# Altium schematic sheet CC2530传感器功能底板.SchDoc
size A3
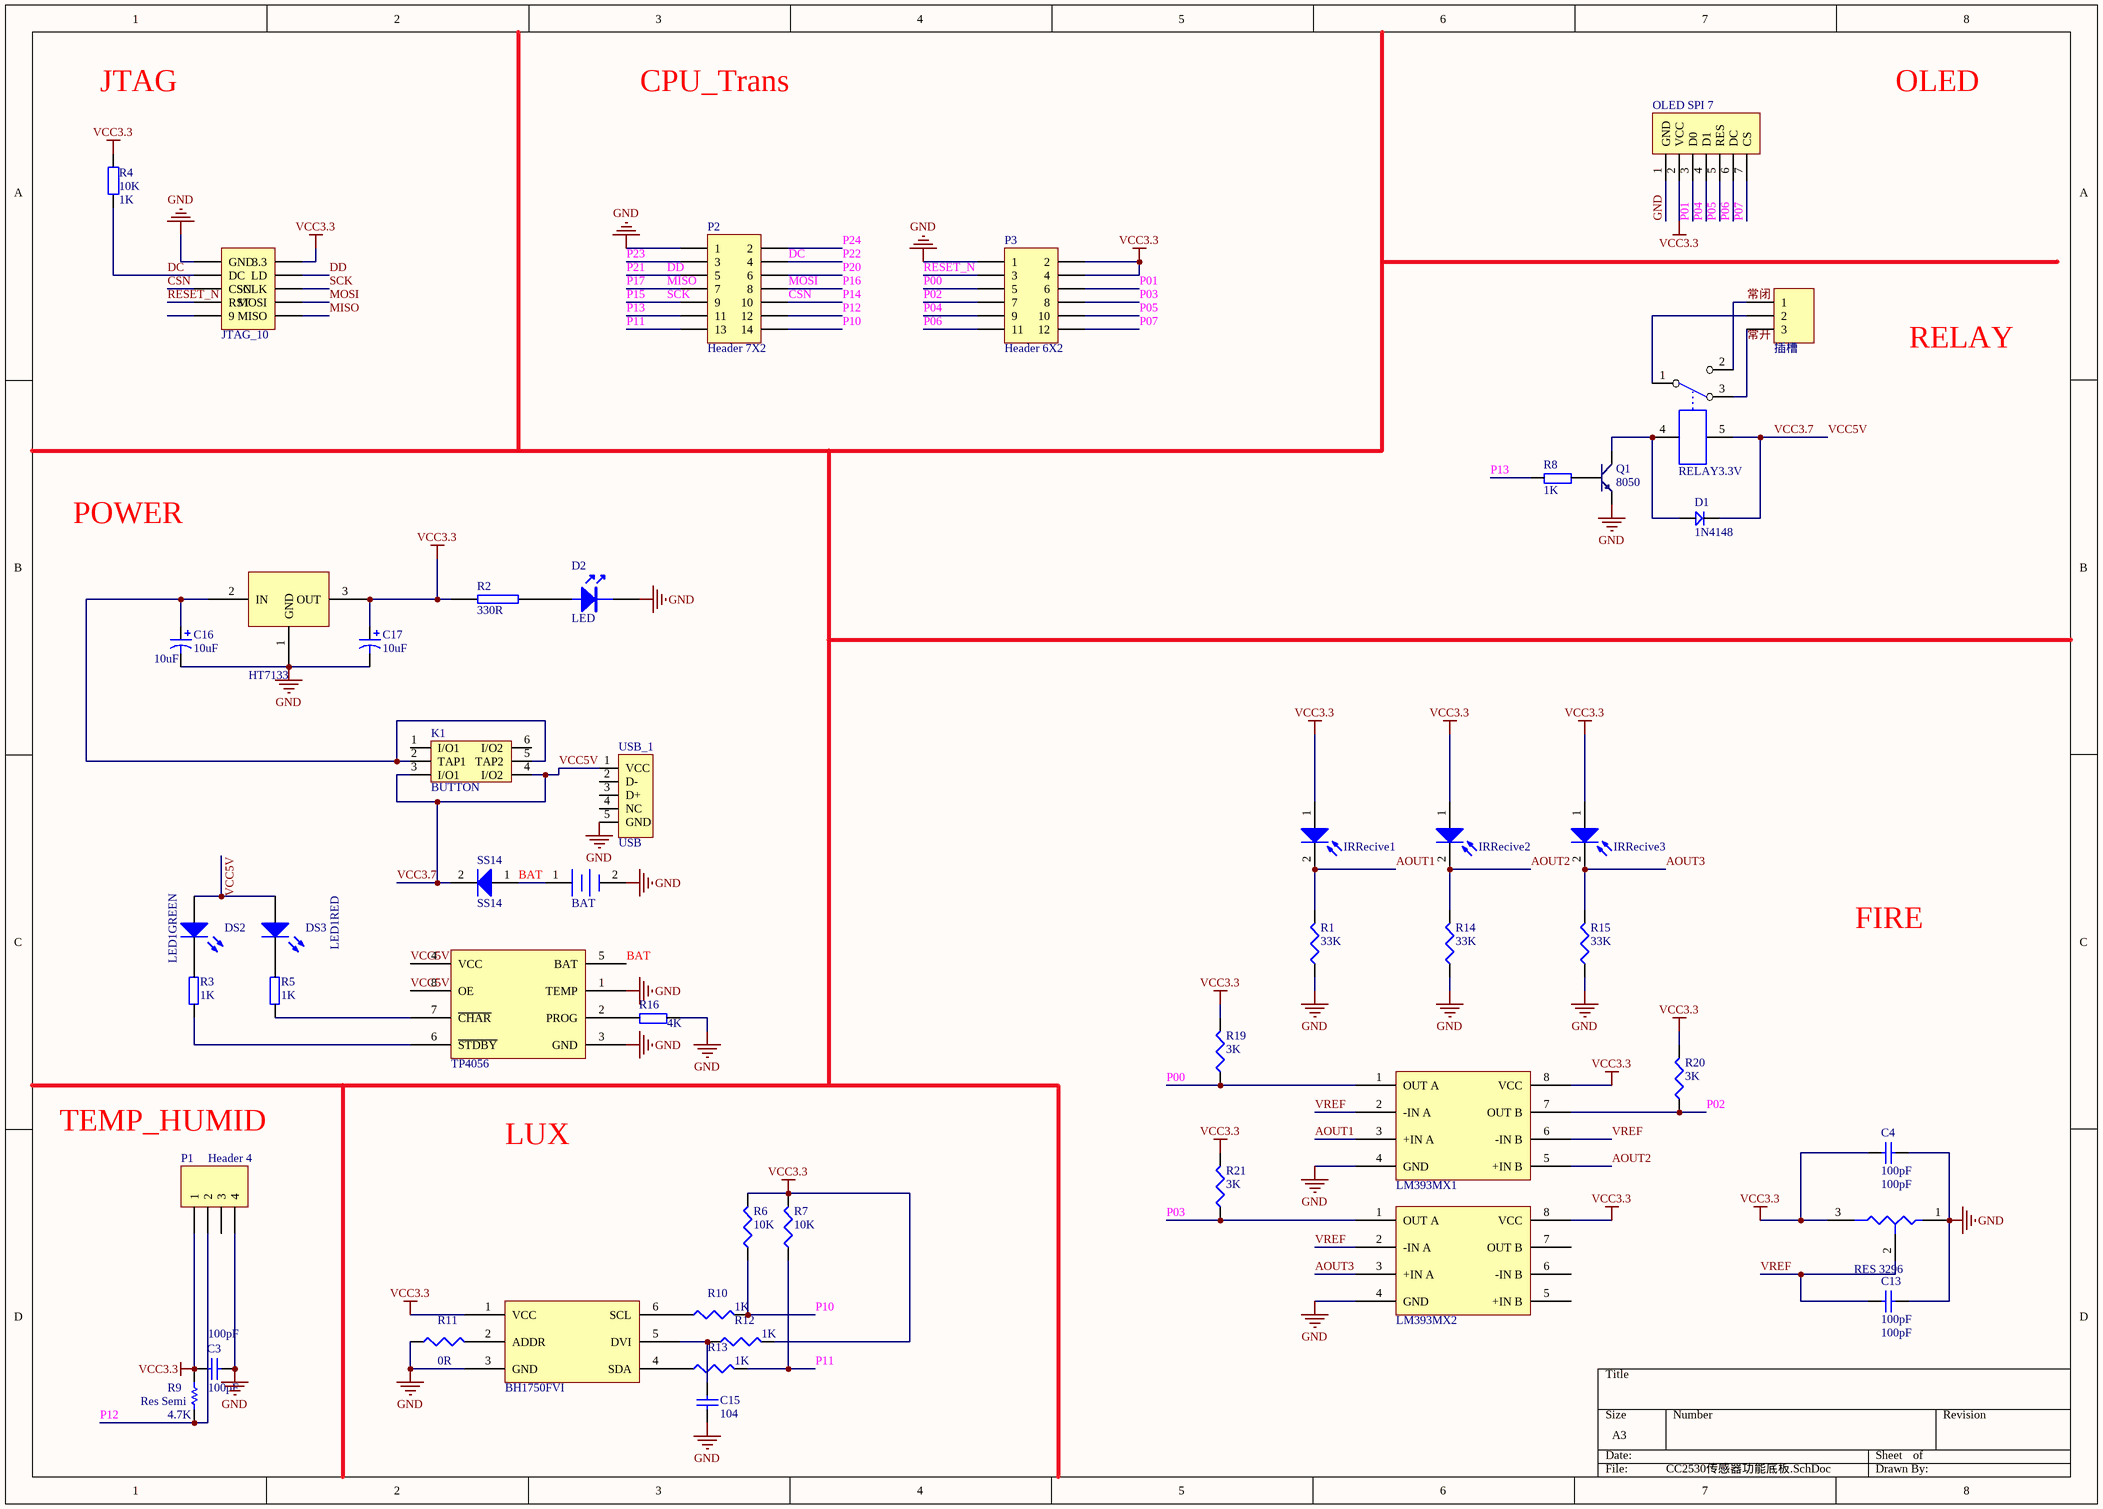
[diagram p0: CC2530传感器功能底板.SchDoc]

## Parts
BAT  BAT  [BAT]  (value not drawn)
BH1750FVI  BH1750FVI  [BH1750FVI]  (value not drawn)
C3  100pF  [DIODE_SOP]
C4  100pF  [DIODE_SOP]
C13  100pF  [DIODE_SOP]
C15  104  [DIODE_SOP]
C16  10uF  [DIODE_SOP]
C17  10uF  [DIODE_SOP]
D1  1N4148  [C1206]
D2  LED  [DIODE_SOP]
DS2  LED1GREEN  [SMDLED]
DS3  LED1RED  [SMDLED]
HT7133  HT7133  [HT7133]  (value not drawn)
IRRecive1  IRRecive  [IRRecive]  (value not drawn)
IRRecive2  IRRecive  [IRRecive]  (value not drawn)
IRRecive3  IRRecive  [IRRecive]  (value not drawn)
JTAG_10  JTAG_10  [JTAG_10]  (value not drawn)
K1  BUTTON  [BTN8.5*8.5]
LM393MX1  LM393MX  [LM393MX]  (value not drawn)
LM393MX2  LM393MX  [LM393MX]  (value not drawn)
OLED_SPI_7  OLED SPI 7  [OLED SPI 7]  (value not drawn)
P1  Header 4  [HDR1X4]
P2  Header 7X2  [HDR2X7]
P3  Header 6X2  [HDR2X6]
Q1  8050  [SOT-23R]
R1  value 33K  [J1-0603]  (hidden comment: Res3)
R2  330R  [J1-0603]
R3  1K  [0603P]
R4  10K  value 1K  [J1-0603]
R5  1K  [0603P]
R6  value 10K  [J1-0603]  (hidden comment: Res3)
R7  value 10K  [J1-0603]  (hidden comment: Res3)
R8  1K  [J1-0603]
R9  Res Semi  value 4.7K  [J1-0603]
R10  value 1K  [J1-0603]  (hidden comment: Res3)
R11  value 0R  [J1-0603]  (hidden comment: Res3)
R12  value 1K  [J1-0603]  (hidden comment: Res3)
R13  value 1K  [J1-0603]  (hidden comment: Res3)
R14  value 33K  [J1-0603]  (hidden comment: Res3)
R15  value 33K  [J1-0603]  (hidden comment: Res3)
R16  4K  [0603P]
R19  value 3K  [J1-0603]  (hidden comment: Res3)
R20  value 3K  [J1-0603]  (hidden comment: Res3)
R21  value 3K  [J1-0603]  (hidden comment: Res3)
RELAY3.3V  RELAY3.3V  [RELAY3.3V]  (value not drawn)
RES_3296  RES 3296  [RES 3296]  (value not drawn)
SS14  SS14  [IN4007]
TP4056  TP4056  [TP4056]  (value not drawn)
USB_1  USB  [USB/SM0.8-6H5]
插槽  插槽  [杜邦线插槽]  (value not drawn)

## Nets
GND: BAT.2(-) BH1750FVI.3(GND) C3.2 C4.2 C13.2 C15.1 C16.2 C17.2 D2.K HT7133.1(GND) JTAG_10.1(GND) LM393MX1.4(GND) LM393MX2.4(GND) OLED_SPI_7.1(GND) P1.4 P2.1 P3.1 Q1.1(E) R1.1 R11.1 R14.1 R15.1 R16.2 RES_3296.1(A) TP4056.1(TEMP) TP4056.3(GND) USB_1.5(GND)
VCC3.3: BH1750FVI.1(VCC) C3.1 C4.1 C17.1 HT7133.3(OUT) IRRecive1.1(A) IRRecive2.1(A) IRRecive3.1(A) JTAG_10.2(3.3) LM393MX1.8(VCC) LM393MX2.8(VCC) OLED_SPI_7.2(VCC) P1.1 P3.2 P3.4 R2.2 R4.2 R6.2 R7.2 R9.2 R12.2 R19.2 R20.2 R21.2 RES_3296.3(B)
AOUT1: IRRecive1.2(K) LM393MX1.3(+IN_A) R1.2
AOUT2: IRRecive2.2(K) LM393MX1.5(+IN_B) R14.2
AOUT3: IRRecive3.2(K) LM393MX2.3(+IN_A) R15.2
BAT: BAT.1(+) SS14.1(A) TP4056.5(BAT)
CSN: JTAG_10.5(CSN) P2.10  [also labelled P14]
DC: JTAG_10.3(DC) P2.4 R4.1  [also labelled P22]
DD: JTAG_10.4(LD) P2.5  [also labelled P21]
MISO: JTAG_10.10(MISO) P2.7  [also labelled P17]
MOSI: JTAG_10.8(MOSI) P2.8  [also labelled P16]
P00: LM393MX1.1(OUT_A) P3.5 R19.1
P01: OLED_SPI_7.3(D0) P3.6
P02: LM393MX1.7(OUT_B) P3.7 R20.1
P03: LM393MX2.1(OUT_A) P3.8 R21.1
P04: OLED_SPI_7.4(D1) P3.9
P05: OLED_SPI_7.5(RES) P3.10
P06: OLED_SPI_7.6(DC) P3.11
P07: OLED_SPI_7.7(CS) P3.12
P10: P2.14 R6.1 R10.2
P11: P2.13 R7.1 R13.2
P12: P1.2 P2.12 R9.1
P13: P2.11 R8.1
P15: JTAG_10.6(SCLK) P2.9  [also labelled SCK]
P20: P2.6
P23: P2.3
P24: P2.2
RESET_N: JTAG_10.7(RST) P3.3
VCC3.7: D1.2 DS2.1(A) DS3.1(A) K1.3(I/O1) K1.4(I/O2) RELAY3.3V.5 SS14.2(K) TP4056.4(VCC) TP4056.8(OE) USB_1.1(VCC)  [also labelled VCC5V]
VREF: C13.1 LM393MX1.2(-IN_A) LM393MX1.6(-IN_B) LM393MX2.2(-IN_A) RES_3296.2(TAP)
常开: RELAY3.3V.3 插槽.3
常闭: RELAY3.3V.2 插槽.1
NetBH1750FVI_2: BH1750FVI.2(ADDR) R11.2
NetBH1750FVI_4: BH1750FVI.4(SDA) R13.1
NetBH1750FVI_5: BH1750FVI.5(DVI) C15.2 R12.1
NetBH1750FVI_6: BH1750FVI.6(SCL) R10.1
NetC16_1: C16.1 HT7133.2(IN) K1.2(TAP1) K1.5(TAP2)
NetD1_1: D1.1 Q1.3(C) RELAY3.3V.4
NetD2_A: D2.A R2.1
NetDS2_2: DS2.2(K) R3.1
NetDS3_2: DS3.2(K) R5.1
NetQ1_2: Q1.2(B) R8.2
NetR3_2: R3.2 TP4056.6(~{STDBY})
NetR5_2: R5.2 TP4056.7(~{CHAR})
NetR16_1: R16.1 TP4056.2(PROG)
NetRELAY3.3V_1: RELAY3.3V.1 插槽.2

Not connected (* = marked no-connect by the designer): JTAG_10 9; K1 1(I/O1) 6(I/O2); LM393MX2 5(+IN_B) 6(-IN_B) 7(OUT_B); P1 3; USB_1 2(D-) 3(D+) 4(NC)

## Notes on the sheet
- JTAG
- CPU_Trans
- OLED
- RELAY
- POWER
- FIRE
- TEMP_HUMID
- LUX

## Library data of the parts
C3 = Cap: Capacitor; Published: 8-Jun-2000; LatestRevisionDate: 17-Jul-2002; LatestRevisionNote: Re-released for DXP Platform.; PackageReference: RAD-0.3; Publisher: Altium Limited; PackageDescription: Radial Cap, Thru-Hole; 2 Leads; 0.3 in Pin Spacing; Value: 100pF
C4 C13 C15 = Cap Semi: Capacitor (Semiconductor SIM Model); Published: 8-Jun-2000; LatestRevisionDate: 29-May-2009; LatestRevisionNote: IPC-7351 Footprint Added.; PackageReference: C1206; Publisher: Altium Limited; PackageDescription: Chip Capacitor
  C4 C13: Value: 100pF
  C15: Value: 104
C16 C17 = Cap Pol1: Polarized Capacitor (Radial); Published: 8-Jun-2000; LatestRevisionDate: 17-Jul-2002; LatestRevisionNote: Re-released for DXP Platform.; PackageReference: RB7.6-15; Publisher: Altium Limited; PackageDescription: Polarized Capacitor (Radial); 2 Leads; Value: 10uF
D1 = D
DS2 DS3 = LED2: Typical RED, GREEN, YELLOW, AMBER GaAs LED; Published: 8-Jun-2000; LatestRevisionDate: 17-Jul-2002; LatestRevisionNote: Re-released for DXP Platform.; PackageDocument: Feb-2002; PackageReference: 3.2X1.6X1.1; Publisher: Altium Limited
P1 = Header 4: Header, 4-Pin; LatestRevisionDate: 17-Jul-2002; LatestRevisionNote: Re-released for DXP Platform.; Publisher: Altium Limited
P2 = Header 7X2: Header, 7-Pin, Dual row; LatestRevisionDate: 17-Jul-2002; LatestRevisionNote: Re-released for DXP Platform.; Publisher: Altium Limited
P3 = Header 6X2: Header, 6-Pin, Dual row; LatestRevisionDate: 17-Jul-2002; LatestRevisionNote: Re-released for DXP Platform.; Publisher: Altium Limited
Q1 = NPN: 8050/BCW846/BCW847
R1 R6 R7 R10-R15 R19-R21 = Res3: Resistor; Published: 8-Jun-2000; LatestRevisionDate: 29-May-2009; LatestRevisionNote: IPC-7351 Footprint Added.; PackageReference: J1-0603; Publisher: Altium Limited; PackageDescription: Chip Resistor
R2 = RES2
R3 R5 R8 R16 = R
R4 = res0402
R9 = Res Semi: Semiconductor Resistor; Published: 8-Jun-2000; LatestRevisionDate: 17-Jul-2002; LatestRevisionNote: Re-released for DXP Platform.; PackageReference: AXIAL-0.5; Publisher: Altium Limited; PackageDescription: Axial Device, Thru-Hole; 2 Leads; 0.5 in Pin Spacing
SS14 = IN4007
USB_1 = USB5